# Altium schematic sheet NBT_SPEAKER_PWM.SCHDOC
size A4; Organization: Altium Limited; Address1: L3, 12a Rodborough Rd; Address2: Frenchs Forest; Address3: NSW; Address4: Australia 2086; DocumentNumber: 4; SheetNumber: 4; SheetTotal: 12
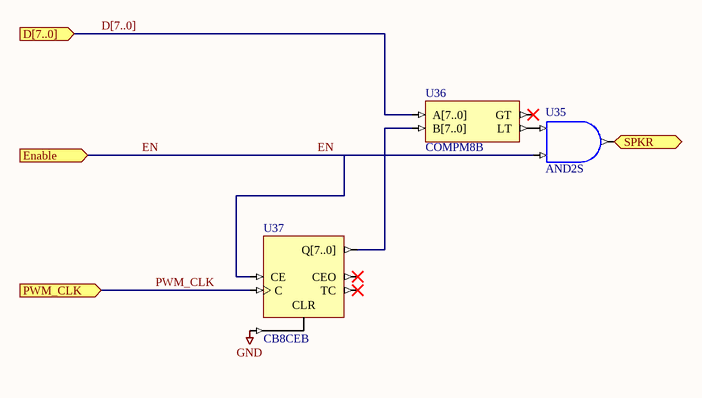
[diagram p0: NBT_SPEAKER_PWM.SCHDOC]

## Parts
U35  AND2S
U36  COMPM8B
U37  CB8CEB

## Ports
D[7..0] (in), Enable (in), PWM_CLK (in), SPKR (out)

## Nets
GND: U37.CLR
D[7..0]: U36.A[7..0] ; port D[7..0]
EN: U35.I1 U37.CE ; port Enable
PWM_CLK: U37.C ; port PWM_CLK
SPKR: U35.O ; port SPKR
NetU35_I0: U35.I0 U36.LT
NetU36_B[7..0]: U36.B[7..0] U37.Q[7..0]

Not connected (* = marked no-connect by the designer): U36 GT*; U37 CEO* TC*

## Buses and harness runs
bus D[7..0] = port D[7..0]

## Notes on the sheet
- Title
- Size:
- Date:
- A4
- Number:
- Time:
- Revision:
- Sheet
- of
- File:

## Library data of the parts
U35 = AND2S: 2-Input AND Gate, Single Pin Version; Xilinx Equivalent: AND2; ArchiveName: GENERIC; Published: 7-Nov-2003; Publisher: Altium Limited; Core Revision: 1.00.00
U36 = COMPM8B: 8-Bit Magnitude Comparator, Bus Version; Xilinx Equivalent: COMPM8; ArchiveName: GENERIC; Published: 7-Nov-2003; Publisher: Altium Limited; Core Revision: 1.00.00
U37 = CB8CEB: 8-Bit Cascadable Binary Counters with Clock Enable and Asynchronous Clear, Bus Version; Xilinx Equivalent: CB8CE; ArchiveName: GENERIC; Published: 7-Nov-2003; Publisher: Altium Limited; Core Revision: 1.00.00